# EasyEDA Pro project 无刷电机驱动板.epro, board PCB3
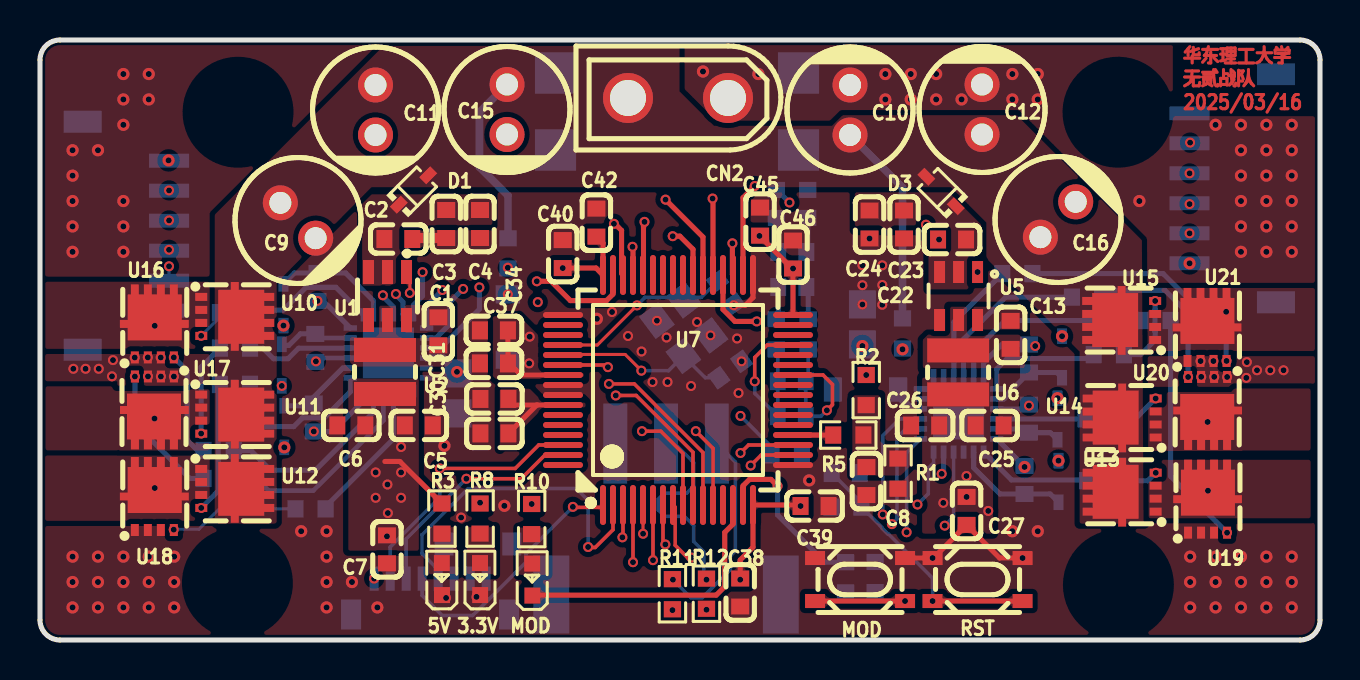
[diagram p9: board, top side]
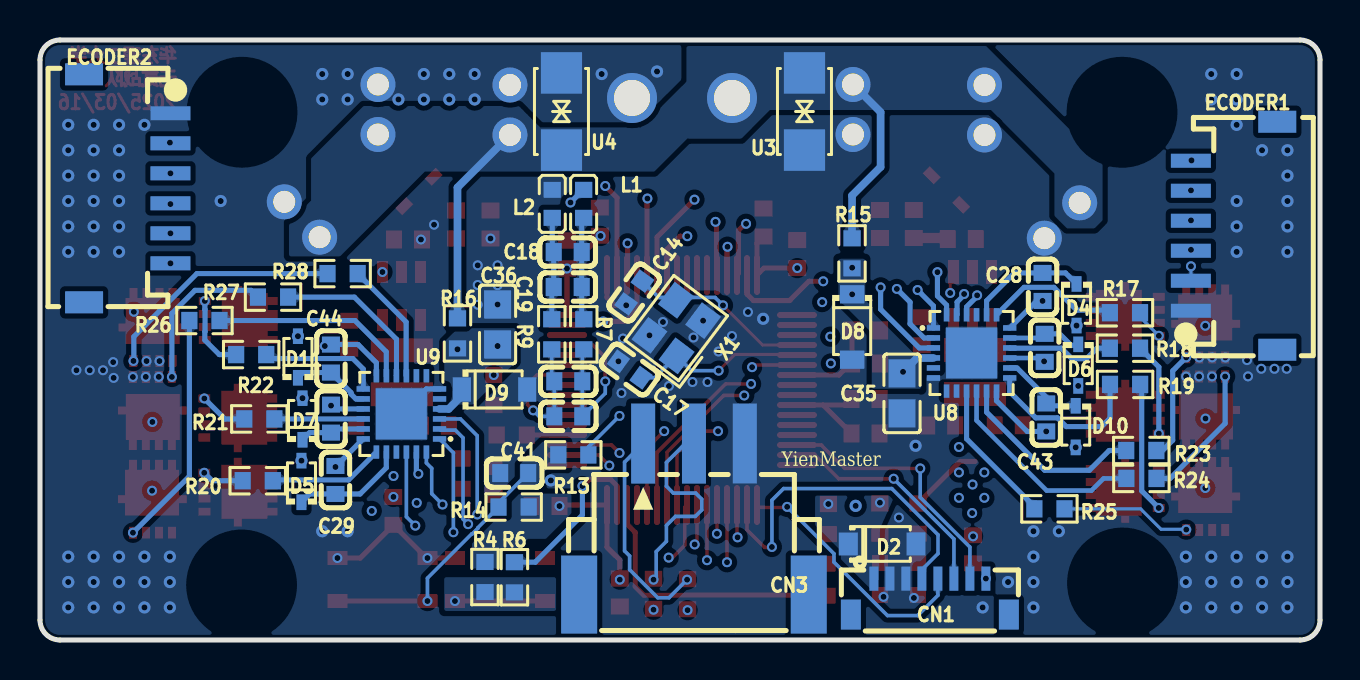
[diagram p10: board, bottom side, seen from below]

Outline 64 x 30 mm; copper layers: Top Layer, Inner1, Inner2, Inner3, Inner4, Bottom Layer. Coordinates in mm from the lower left corner of the outline.
Outline path: 0,29 0,1 arc(0.29,0.29) 1,0 63,0 arc(63.71,0.29) 64,1 64,29 arc(63.71,29.71) 63,30 1,30 arc(0.29,29.71) 0,29
Stack: Top Layer 0.035mm 外层铜厚1oz / Dielectric1 0.0994mm 3313 RC57% 4.2mil / Inner1 0.0152mm 内层铜厚 / Dielectric2 0.55mm 0.55mm H/H No copper / Inner2 0.0152mm 内层铜厚 / Dielectric3 0.1088mm 2116 RC54% 4.9mil / Inner3 0.0152mm 内层铜厚 / Dielectric4 0.55mm 0.55mm H/H No copper / Inner4 0.0152mm 内层铜厚 / Dielectric5 0.0994mm 3313 RC57% 4.2mil / Bottom Layer 0.035mm 外层铜厚1oz

## Design rules (mm)
net ECO_IN: DP1
net ECO_OUT: DP1
net UART_TX: DP2
net UART_RX: DP2
net $1N18423: DP3
net $1N18427: DP3
template: 自定义配置
spacing copperThickness1oz (default): track to track 0.102, other pairs 0.152 to 0.3
spacing copperThickness2oz: track to track 0.203, other pairs 0.152 to 0.3
track width copperThickness1oz (default): min 0.127, default 0.254, max 2.54
track width copperThickness2oz: min 0.203, default 0.254, max 2.54
differential pair differentialPair (default): width min 0.127, default 0.254, max 2.54; gap min 0.152, default 0.152
via viaSize (default): diameter min 0.5, default 0.61, max 10; hole min 0.3, default 0.305, max 6.3

## Placement (name value [footprint] x y rotation side)
3.3V  NCD0603R1  [LED0603-RD_RED]  22 3.05 90 top
5V  NCD0603R1  [LED0603-RD_RED]  20.1 3.05 90 top
C1  100nF  [C0603]  19.92 15.43 270 top
C2  10uF  [C0603]  17.91 20.05 180 top
C3  100nF  [C0603]  20.31 20.8 90 top
C4  10nF  [C0603]  22 20.8 90 top
C5  22uF  [C0603]  18.94 10.73 180 top
C6  22uF  [C0603]  15.56 10.73 0 top
C7  100nF  [C0603]  17.35 4.53 270 top
C8  100nF  [C0603]  41.32 7.95 90 top
C9  220uF  [CAP-TH_BD6.3-P2.50-D0.6-FD-1]  12.9 20.97 315 top
C10  220uF  [CAP-TH_BD6.3-P2.50-D0.6-FD-1]  40.5 26.5 90 top
C11  220uF  [CAP-TH_BD6.3-P2.50-D0.6-FD-1]  16.78 26.5 270 top
C12  220uF  [CAP-TH_BD6.3-P2.50-D0.6-FD-1]  47.1 26.53 90 top
C13  100nF  [C0603]  48.53 15.26 270 top
C14  10pF  [C0603]  34.29 17.37 305.7 bottom
C15  220uF  [CAP-TH_BD6.3-P2.50-D0.6-FD-1]  23.35 26.53 270 top
C16  220uF  [CAP-TH_BD6.3-P2.50-D0.6-FD-1]  50.9 21.02 45 top
C17  10pF  [C0603]  34.51 13.52 215.8 bottom
C18  4.7uF  [C0603]  37.62 19.4 180 bottom
C19  100nF  [C0603]  37.62 17.65 180 bottom
C20  2.2uF  [C0603]  37.59 12.93 180 bottom
C21  100nF  [C0603]  37.59 11.18 180 bottom
C22  10uF  [C0603]  45.6 20.02 0 top
C23  100nF  [C0603]  43.2 20.77 90 top
C24  10nF  [C0603]  41.48 20.77 90 top
C25  22uF  [C0603]  47.48 10.72 180 top
C26  22uF  [C0603]  44.26 10.72 0 top
C27  100nF  [C0603]  46.33 6.45 270 top
C28  4.7uF  [C0603]  13.87 17.65 90 bottom
C29  4.7uF  [C0603]  49.23 8 270 bottom
C30  4.7uF  [C0603]  22.72 10.33 180 top
C31  100nF  [C0603]  22.72 12.05 180 top
C32  4.7uF  [C0603]  13.77 14.61 90 bottom
C33  4.7uF  [C0603]  49.45 11.07 270 bottom
C34  4.7uF  [C0603]  22.7 13.83 180 top
C35  22uF  [C0805]  20.9 12.33 90 bottom
C36  22uF  [C0805]  41.12 15.78 270 bottom
C37  100nF  [C0603]  22.7 15.48 180 top
C38  4.7uF  [C0603]  35.01 2.38 90 top
C39  100nF  [C0603]  38.73 6.7 180 top
C40  4.7uF  [C0603]  26.14 19.3 90 top
C41  100nF  [C0603]  40.29 8.35 180 bottom
C42  100nF  [C0603]  27.82 20.87 90 top
C43  4.7uF  [C0603]  13.69 11.13 270 bottom
C44  4.7uF  [C0603]  49.45 14.07 90 bottom
C45  4.7uF  [C0603]  36 20.92 270 top
C46  100nF  [C0603]  37.65 19.27 270 top
CN1  HC-0.8-8PWT  [CONN-SMD_8P-P0.80_HCTL_HC-0.8-8PWT]  19.51 2.17 180 bottom
CN2  XT30UPB-M  [CONN-TH_XT30UPB-M]  31.9 27.1 180 top
CN3  ZX-XH2.54-3PWT  [CONN-SMD_3P-P2.54-XH2.54-WT]  31.3 6.05 180 bottom
D1  B5819WS  [SOD-323_L1.7-W1.3-LS2.5-FD]  18.68 22.5 225 top
D2  SMF3.3A  [SOD-123_L2.8-W1.8-LS3.7-RD]  21.89 4.8 180 bottom
D3  B5819WS  [SOD-323_L1.7-W1.3-LS2.5-FD]  45.05 22.42 315 top
D4  B5819WS  [SOD-323_L1.7-W1.3-LS2.5-FD]  12.17 16.76 90 bottom
D5  B5819WS  [SOD-323_L1.7-W1.3-LS2.5-FD]  50.93 7.93 270 bottom
D6  B5819WS  [SOD-323_L1.7-W1.3-LS2.5-FD]  12.09 13.74 90 bottom
D7  B5819WS  [SOD-323_L1.7-W1.3-LS2.5-FD]  50.88 11.05 270 bottom
D8  BZT52C15  [SOD-123_L2.7-W1.6-LS3.7-RD]  23.39 15.65 270 bottom
D9  BZT52C15  [SOD-123_L2.7-W1.6-LS3.7-RD]  41.27 12.53 180 bottom
D10  B5819WS  [SOD-323_L1.7-W1.3-LS2.5-FD]  12.22 10.67 90 bottom
D11  B5819WS  [SOD-323_L1.7-W1.3-LS2.5-FD]  51.1 14.15 270 bottom
ECODER1  ZH-6AWB  [CONN-SMD_6P-P1.50_ZH-6AWB]  4.3 20.21 90 bottom
ECODER2  ZH-6AWB  [CONN-SMD_6P-P1.50_ZH-6AWB]  59.64 22.58 270 bottom
L1  BLM18PG121SN1D  [L0603]  36.82 21.81 270 bottom
L2  BLM18PG121SN1D  [L0603]  38.39 21.81 270 bottom
MOD  -  [SW-SMD_4P-L4.2-W3.2-P2.15-LS4.6-1]  41 3.02 0 top
MOD#2  -  [LED0603-RD_RED]  24.62 3.02 90 top
R1  1kΩ  [R0603]  42.9 8.32 90 top
R2  10kΩ  [R0603]  41.31 12.5 90 top
R3  4.7kΩ  [R0603]  20.1 6.07 270 top
R4  4.7kΩ  [R0603]  41.75 3.15 270 bottom
R5  100Ω  [R0603]  40.41 10.25 180 top
R6  100Ω  [R0603]  40.28 3.14 270 bottom
R7  0Ω  [R0603]  36.81 15.28 270 bottom
R8  1kΩ  [R0603]  22 6.07 270 top
R9  0Ω  [R0603]  38.41 15.28 270 bottom
R10  1kΩ  [R0603]  24.58 6.05 270 top
R11  100Ω  [R0603]  31.62 2.29 90 top
R12  100Ω  [R0603]  33.32 2.31 90 top
R13  100Ω  [R0603]  37.33 9.26 180 bottom
R14  10kΩ  [R0603]  40.32 6.65 180 bottom
R15  100Ω  [R0603]  23.4 19.33 270 bottom
R16  100Ω  [R0603]  43.13 15.33 270 bottom
R17  4.7Ω  [R0603]  9.75 16.36 180 bottom
R18  4.7Ω  [R0603]  9.75 14.59 180 bottom
R19  4.7Ω  [R0603]  9.75 12.78 180 bottom
R20  4.7Ω  [R0603]  53.11 7.96 0 bottom
R21  4.7Ω  [R0603]  53.03 11.05 0 bottom
R22  4.7Ω  [R0603]  53.44 14.27 0 bottom
R23  4.7Ω  [R0603]  8.94 9.48 180 bottom
R24  4.7Ω  [R0603]  8.93 8.08 180 bottom
R25  4.7Ω  [R0603]  13.53 6.56 180 bottom
R26  4.7Ω  [R0603]  55.78 15.97 0 bottom
R27  4.7Ω  [R0603]  52.35 17.14 0 bottom
R28  4.7Ω  [R0603]  48.87 18.32 0 bottom
RST  TS3425BA  [SW-SMD_4P-L4.2-W3.2-P2.15-LS4.6-1]  46.88 3.02 0 top
U1  AP63205WU-7  [TSOT-23-6_L2.9-W1.6-P0.95-LS2.8-BL]  17.38 17.2 180 top
U2  4.7uH  [IND-SMD_L3.0-W3.0_FTC303020D]  17.25 13.4 270 top
U3  SMAJ16CA  [DO-214AC_L4.3-W2.7-LS5.0-BI]  25.78 26.42 90 bottom
U4  SMAJ16CA  [DO-214AC_L4.3-W2.7-LS5.0-BI]  37.93 26.42 90 bottom
U5  AP63203WU-7  [TSOT-26_L2.9-W1.6-P0.95-LS2.8-BL]  45.93 17.2 180 top
U6  4.7uH  [IND-SMD_L3.0-W3.0_FTC303020D]  45.91 13.38 270 top
U7  CYT2BL3CAAQ0AZEGST  [LQFP-64_L10.0-W10.0-P0.50-LS12.0-BL]  31.9 12.5 0 top
U8  FD6288Q  [QFN-24_L4.0-W4.0-P0.50-BL-EP2.6]  17.42 14.35 270 bottom
U9  FD6288Q  [QFN-24_L4.0-W4.0-P0.50-BL-EP2.6]  45.93 11.3 90 bottom
U10  TPN2R703NL,L1Q(M  [TSON-8_L3.1-W3.1-P0.65-LS3.3-BL-EP]  9.74 16.18 270 top
U11  TPN2R703NL,L1Q(M  [TSON-8_L3.1-W3.1-P0.65-LS3.3-BL-EP]  9.74 11.29 270 top
U12  TPN2R703NL,L1Q(M  [TSON-8_L3.1-W3.1-P0.65-LS3.3-BL-EP]  9.74 7.58 270 top
U13  TPN2R703NL,L1Q(M  [TSON-8_L3.1-W3.1-P0.65-LS3.3-BL-EP]  54.11 7.39 90 top
U14  TPN2R703NL,L1Q(M  [TSON-8_L3.1-W3.1-P0.65-LS3.3-BL-EP]  54.11 11.1 90 top
U15  TPN2R703NL,L1Q(M  [TSON-8_L3.1-W3.1-P0.65-LS3.3-BL-EP]  54.08 15.98 90 top
U16  TPN2R703NL,L1Q(M  [TSON-8_L3.1-W3.1-P0.65-LS3.3-BL-EP]  5.72 15.81 0 top
U17  TPN2R703NL,L1Q(M  [TSON-8_L3.1-W3.1-P0.65-LS3.3-BL-EP]  5.72 11.5 180 top
U18  TPN2R703NL,L1Q(M  [TSON-8_L3.1-W3.1-P0.65-LS3.3-BL-EP]  5.72 7.17 0 top
U19  TPN2R703NL,L1Q(M  [TSON-8_L3.1-W3.1-P0.65-LS3.3-BL-EP]  58.38 7.04 0 top
U20  TPN2R703NL,L1Q(M  [TSON-8_L3.1-W3.1-P0.65-LS3.3-BL-EP]  58.38 11.48 180 top
U21  TPN2R703NL,L1Q(M  [TSON-8_L3.1-W3.1-P0.65-LS3.3-BL-EP]  58.35 15.63 0 top
X1  16MHz  [CRYSTAL-SMD_4P-L3.2-W2.5-BL]  32.19 15.6 127 bottom

## Footprints (pads in the part's own frame, mm; a bottom-side part is the same pattern mirrored in y, then rotated)
C0603
  rect 0.8x0.9 smd: 1(-0.7,0) 2(0.7,0)
C0805
  rect 1.41x1.35 smd: 1(-1,0) 2(1,0)
CAP-TH_BD6.3-P2.50-D0.6-FD-1
  round 1.75 hole 1.1: 1(-1.25,0) 2(1.25,0)
CONN-SMD_3P-P2.54-XH2.54-WT
  rect 1.2x4 smd: 1(-2.54,3.775) 2(0,3.775) 3(2.54,3.775)
  rect 1.8x3.9 smd: 4(-5.74,-3.775) 5(5.74,-3.775)
CONN-SMD_6P-P1.50_ZH-6AWB
  rect 0.7x2 smd: 1(-3.75,2.16) 2(-2.25,2.16) 3(-0.75,2.16) 4(0.75,2.16) 5(2.25,2.16) 6(3.75,2.16)
  rect 1.1x1.9 smd: 7(5.7,-2.159) 8(-5.7,-2.16)
CONN-SMD_8P-P0.80_HCTL_HC-0.8-8PWT
  rect 0.45x1.208 smd: 1(-2.8,0.898) 2(-2,0.898) 3(-1.2,0.898) 4(-0.4,0.898) 5(0.4,0.898) 6(1.2,0.898) 7(2,0.898) 8(2.8,0.898)
  rect 1x1.5 smd: 9(3.95,-0.898) 10(-3.95,-0.898)
CONN-TH_XT30UPB-M
  round 2.5 hole 1.8: 1(-2.5,0) 2(2.5,0)
CRYSTAL-SMD_4P-L3.2-W2.5-BL
  rect 1.4x1.2 smd: 1(-1.1,-0.85) 2(1.1,-0.85) 3(1.1,0.85) 4(-1.1,0.85)
DO-214AC_L4.3-W2.7-LS5.0-BI
  rect 2.07x2.06 smd: 1(-1.929,0) 2(1.929,0)
IND-SMD_L3.0-W3.0_FTC303020D
  rect 1.2x3.1 smd: 1(-1.1,0) 2(1.1,0)
L0603
  rect 0.8x0.864 smd: 1(-0.7,0) 2(0.7,0)
LED0603-RD_RED
  rect 0.8x0.8 smd: 1(-0.799,-0.004) 2(0.799,0.004)
LQFP-64_L10.0-W10.0-P0.50-LS12.0-BL
  oval 0.3x2 smd: 1(-3.75,-5.75) 2(-3.25,-5.75) 3(-2.75,-5.75) 4(-2.25,-5.75) 5(-1.75,-5.75) 6(-1.25,-5.75) 7(-0.75,-5.75) 8(-0.25,-5.75) 9(0.25,-5.75) 10(0.75,-5.75) 11(1.25,-5.75) 12(1.75,-5.75) 13(2.25,-5.75) 14(2.75,-5.75) 15(3.25,-5.75) 16(3.75,-5.75) 33(3.75,5.75) 34(3.25,5.75) 35(2.75,5.75) 36(2.25,5.75) 37(1.75,5.75) 38(1.25,5.75) 39(0.75,5.75) 40(0.25,5.75) 41(-0.25,5.75) 42(-0.75,5.75) 43(-1.25,5.75) 44(-1.75,5.75) 45(-2.25,5.75) 46(-2.75,5.75) 47(-3.25,5.75) 48(-3.75,5.75)
  oval 2x0.3 smd: 17(5.75,-3.75) 18(5.75,-3.25) 19(5.75,-2.75) 20(5.75,-2.25) 21(5.75,-1.75) 22(5.75,-1.25) 23(5.75,-0.75) 24(5.75,-0.25) 25(5.75,0.25) 26(5.75,0.75) 27(5.75,1.25) 28(5.75,1.75) 29(5.75,2.25) 30(5.75,2.75) 31(5.75,3.25) 32(5.75,3.75) 49(-5.75,3.75) 50(-5.75,3.25) 51(-5.75,2.75) 52(-5.75,2.25) 53(-5.75,1.75) 54(-5.75,1.25) 55(-5.75,0.75) 56(-5.75,0.25) 57(-5.75,-0.25) 58(-5.75,-0.75) 59(-5.75,-1.25) 60(-5.75,-1.75) 61(-5.75,-2.25) 62(-5.75,-2.75) 63(-5.75,-3.25) 64(-5.75,-3.75)
QFN-24_L4.0-W4.0-P0.50-BL-EP2.6
  rect 0.28x0.665 smd: 1(-1.25,-1.907) 2(-0.75,-1.907) 3(-0.25,-1.907) 4(0.25,-1.907) 5(0.75,-1.907) 6(1.25,-1.907) 13(1.25,1.907) 14(0.75,1.907) 15(0.25,1.907) 16(-0.25,1.907) 17(-0.75,1.907) 18(-1.25,1.907)
  rect 0.665x0.28 smd: 7(1.907,-1.25) 8(1.907,-0.75) 9(1.907,-0.25) 10(1.907,0.25) 11(1.907,0.75) 12(1.907,1.25) 19(-1.907,1.25) 20(-1.907,0.75) 21(-1.907,0.25) 22(-1.907,-0.25) 23(-1.907,-0.75) 24(-1.907,-1.25)
  rect 2.55x2.55 smd: 25(0,0)
R0603
  rect 0.806x0.864 smd: 1(-0.753,0) 2(0.753,0)
SOD-123_L2.7-W1.6-LS3.7-RD
  rect 0.91x1.22 smd: 1(-1.635,0) 2(1.635,0)
SOD-123_L2.8-W1.8-LS3.7-RD
  rect 0.95x1.15 smd: 1(-1.692,0) 2(1.692,0)
SOD-323_L1.7-W1.3-LS2.5-FD
  rect 0.78x0.5 smd: 1(-1.04,0) 2(1.04,0)
SW-SMD_4P-L4.2-W3.2-P2.15-LS4.6-1
  rect 1x0.7 smd: 1(-2.25,1.075) 2(2.25,1.075) 3(-2.25,-1.075) 4(2.25,-1.075)
TSON-8_L3.1-W3.1-P0.65-LS3.3-BL-EP
  rect 0.4x0.6 smd: 1(-0.975,-1.675) 2(-0.325,-1.675) 3(0.325,-1.675) 4(0.975,-1.675) 5(0.975,1.675) 6(0.325,1.675) 7(-0.325,1.675) 8(-0.975,1.675)
  rect 0.6x0.4 smd: 9(-1.42,0) 9(1.42,0)
  rect 2.7x2.3 smd: 9(0.02,0.325)
TSOT-23-6_L2.9-W1.6-P0.95-LS2.8-BL
  rect 0.55x1.2 smd: 1(-0.95,-1.2) 2(0,-1.2) 3(0.95,-1.2) 4(0.95,1.2) 5(0,1.2) 6(-0.95,1.2)
TSOT-26_L2.9-W1.6-P0.95-LS2.8-BL
  rect 0.55x1.1 smd: 1(-0.95,-1.2) 2(0,-1.2) 3(0.95,-1.2) 4(0.95,1.2) 5(0,1.2) 6(-0.95,1.2)

## Nets
As in the schematic, except:
GND: 3.3V.1 5V.1 C2.1 C3.1 C4.1 C5.1 C6.1 C7.2 C8.1 C9.2 C10.2 C11.2 C12.2 C14.2 C15.2 C16.2 C17.1 C22.1 C23.1 C24.1 C25.1 C26.1 C27.2 C30.2 C31.2 C34.2 C35.1 C36.1 C37.2 C38.1 C39.1 C40.2 C41.1 C42.2 C45.1 C46.1 CN1.2 CN1.3 CN2.1 CN3.3 D2.2 D8.2 D9.2 ECODER1.1 ECODER2.1 L2.1 MOD.1 MOD.2 R1.1 RST.1 RST.2 U1.4 U3.1 U4.2 U5.4 U7.17 U7.33 U7.49 U7.56 U7.57 U8.6 U8.25 U9.6 U9.25 U16.1 U16.2 U16.3 U17.1 U17.2 U17.3 U18.1 U18.2 U18.3 U19.1 U19.2 U19.3 U20.1 U20.2 U20.3 U21.1 U21.2 U21.3 X1.2 X1.4
LEDMOD: MOD#2.1 U7.14
RST: C41.2 CN1.8 R13.1 R14.1 RST.3 RST.4
$1N10004: MOD.3 MOD.4 R4.2 R6.2
$1N10532: 3.3V.2 R8.2
$1N10536: MOD#2.2 R10.2
$1N11617: 5V.2 R3.2

Pads without a net: CN1 9 10; CN3 4 5; ECODER1 7 8; ECODER2 7 8; U7 13 21 22 23 24 25 30 31 40 41 42 43 50 51; U8 5 7 8 21; U9 5 7 8 21

## Via types
v1: diameter 0.61, hole 0.305, Top Layer to Bottom Layer, 99 vias
v2: diameter 0.5, hole 0.3, Top Layer to Bottom Layer, 154 vias
v3: diameter 0.5, hole 0.299, Top Layer to Bottom Layer, 7 vias
v4: diameter 0.584, hole 0.3, Top Layer to Bottom Layer, 1 via
v5: diameter 0.61, hole 0.3, Top Layer to Bottom Layer, 1 via

## Routing (per net, layer and track width the routed paths; a pad name or vN(x,y) marks a point on that pad's centre or on a via; arc(x,y) is an arc through that point)
+5V: length 130.4
  Top Layer w0.152: v2(18.49,17.35) 18.49,18.24 U1.1
  Top Layer w0.254: R3.1 18,8.93 17.24,8.93
  Inner3 w0.254: 17.58,10.42 19.86,10.42 22.88,13.44 22.88,15.95 24.05,17.12 24.05,19.36 23.6,19.81 21.69,19.81 19.22,17.35 v2(18.49,17.35)
  Inner3 w0.381: v1(57.48,18.83) 57.55,18.76 62.75,18.76 63.02,18.49 63.02,6.58 52.78,6.58 47.1,0.9 24.25,0.9 v2(17.37,7.78) 7.54,7.78 6.5,6.73 2.12,6.73 1.07,7.78 1.07,17.26 2.91,19.1 2.91,23.47 3.42,23.98 v1(6.43,23.98)
  vias: v2(17.35,5.18) v3(16.78,8.38) v3(16.78,7.11) v3(17.39,6.35) v3(18.05,9.65) v3(18.05,8.38) v3(18.05,7.11)
GND: length 13.6
  Top Layer w0.254: v2(34.69,16.74) 35.26,16.74 35.65,17.12 35.65,18.25 U7.33 ; MOD.2 v2(44.63,4.1) 44.67,4.1 C27.2 47.98,4.1 v2(49.13,4.1)
  Top Layer w0.508: C2.1 18.66,20.1 C3.1
  Bottom Layer w0.254: U9.25 44.68,12.55 44.02,12.55
  vias: v1(1.63,24.49) v1(1.63,23.22) v1(1.63,21.95) v1(1.63,20.68) v1(1.63,19.41) v1(1.63,4.17) v1(1.63,2.9) v1(1.63,1.63) v1(2.9,24.49) v1(2.9,4.17) v1(2.9,2.9) v1(2.9,1.63) v1(4.17,28.3) v1(4.17,27.03) v1(4.17,25.76) v1(4.17,21.95) v1(4.17,20.68) v1(4.17,19.41) v1(4.17,4.17) v1(4.17,2.9) v1(4.17,1.63) v1(5.44,28.3) v1(5.44,27.03) v1(5.44,4.17) v1(5.44,2.9) v1(5.44,1.63) v1(6.71,4.17) v1(6.71,2.9) v1(6.71,1.63) v1(13.06,5.44) v1(14.33,5.44) v1(14.33,4.17) v1(14.33,2.9) v1(14.33,1.63) v1(15.6,2.9) v1(16.87,1.63) v1(20.22,9.71) v1(23.22,6.71) v1(27.84,16.06) v1(33.15,28.42) v1(35.92,28.3) v1(38.46,7.98) v1(42.27,28.3) v1(42.27,27.03) v1(43.54,28.3) v1(43.54,27.03) v1(44.81,28.3) v1(44.81,27.03) v1(46.08,27.03) v1(48.62,28.3) v1(48.62,27.03) v1(48.62,5.44) v1(49.89,28.3) v1(49.89,27.03) v1(49.89,5.44) v1(54.97,21.95) v1(57.51,4.17) v1(57.51,2.9) v1(57.51,1.63) v1(58.78,25.76) v1(58.78,4.17) v1(58.78,2.9) v1(58.78,1.63) v1(60.05,25.76) v1(60.05,24.49) v1(60.05,23.22) v1(60.05,21.95) v1(60.05,20.68) v1(60.05,19.41) v1(60.05,4.17) v1(60.05,2.9) v1(60.05,1.63) v1(61.32,25.76) v1(61.32,24.49) v1(61.32,23.22) v1(61.32,21.95) v1(61.32,20.68) v1(61.32,19.41) v1(61.32,4.17) v1(61.32,2.9) v1(61.32,1.63) v1(62.59,25.76) v1(62.59,24.49) v1(62.59,23.22) v1(62.59,21.95) v1(62.59,20.68) v1(62.59,19.41) v1(62.59,4.17) v1(62.59,2.9) v1(62.59,1.63) v2(1.67,13.56) v2(2.28,13.56) v2(2.94,13.56) v2(3.65,14) v2(4.74,14.12) v2(5.39,14.13) v2(5.4,13.18) v2(6.04,14.12) v2(6.04,13.17) v2(6.69,13.17) v2(20.3,2.1) v2(21.06,6.12) v2(21.82,2.16) v2(28.6,16.4) v2(29.4,15.2) v2(30.08,14.42) v2(30.63,12.9) v2(30.85,15.97) v2(31.33,15.12) v2(31.38,12.9) v2(32.55,12.7) v2(32.85,15.9) v2(33.53,15.23) v2(34.85,15.08) v2(34.93,12.35) v2(35.08,13.93) v2(41.12,18.73) v2(41.12,17.74) v2(41.12,16.78) v2(41.48,20.07) v2(42.11,18.73) v2(42.11,17.75) v2(42.11,16.76) v2(44.3,20.77) v2(44.95,20.02) v2(58.03,13.95) v2(58.06,13.16) v2(58.67,13.95) v2(58.71,13.16) v2(59.36,13.15) v2(60.34,13.89) v2(60.32,13.11) v2(60.85,13.49) v2(61.51,13.49) v2(62.18,13.49) v3(3.6,13.18)
VBAT: length 40.2
  Inner2 w0.254: v2(41.31,13.25) 40.04,14.52 36.15,14.52 32.67,18 32.67,23.83 CN2.2
  Bottom Layer w0.381: R15.1 23.4,22.22 21.97,23.65 21.97,26.39 C15.1 ; C10.1 43.13,22.63 R16.1
VCC1V1: length 4.9
  Top Layer w0.254: 24.84,11.75 23.72,11.75 C31.1 ; 24.84,11.75 U7.58 ; 24.84,11.75 C30.1
VCC3V3: length 36.8
  Top Layer w0.254: C37.1 23.4,13.9 24.05,13.25 U7.55 ; v2(26.14,18.6) 27.8,18.6 U7.48 28.15,19.84 C42.1 ; U7.32 37.65,18.53 v2(35.97,20.2) ; v2(35.01,3.02) 35.01,4 35.65,4.64 U7.16 37.98,6.75 v2(38.03,6.7)
  Inner2 w0.254: v2(46.32,8.2) 46.88,8.75 v2(46.88,18.4)
  Inner3 w0.178: v2(22,6.87) 22,7.5 24.05,9.55 ; v2(24.58,6.8) 24.58,8.28 25.02,8.72
  Bottom Layer w0.254: v2(37.47,21.88) 36.84,22.51 L1.1
  vias: v2(24.48,15.17) v2(24.46,13.83) v2(24.89,16.89) v2(37.65,18.57) v2(45.16,6.86) v2(46.33,7.15) v2(47.41,6.45)
BATADC: length 2
  Top Layer w0.254: R5.2 37.65,10.25 U7.20
DBG_RX: length 12.8
  Top Layer w0.178: U7.1 28.03,6.63 26.64,6.63
  Bottom Layer w0.178: CN1.5 19.11,2.23 20.12,1.22 21.63,1.22 24.3,3.9 24.3,4.32 v2(26.64,6.66)
DBG_TX: length 17.2
  Top Layer w0.178: 27.41,4.63 27.76,4.63 28.65,5.51 U7.2
  Bottom Layer w0.178: 27.41,4.65 27.41,6.99 26.82,7.57 21.41,7.57 19.1,5.26 19.1,4.32 19.91,3.51 CN1.4
  vias: v2(27.41,4.65)
ECD1_CS: length 35.6
  Top Layer w0.178: U7.12 33.65,6.75 33.65,9.58 v2(32.79,10.44)
  Inner2 w0.178: v2(6.45,18.69) 6.73,18.4 7.09,18.4 16.37,9.12 29.52,9.12 30.85,10.44 v2(32.79,10.44)
  Bottom Layer w0.152: v2(6.45,18.69) 6.45,17.97 ECODER1.2
ECD1_MISO: length 32.5
  Top Layer w0.178: U7.9 32.15,9.33 31.04,10.44 v2(30.1,10.44)
  Inner2 w0.178: v2(30.1,10.44) 16.03,10.44 6.97,19.51 v2(6.45,19.51)
ECD1_MOSI: length 33.6
  Top Layer w0.178: U7.10 32.65,9.39 29.81,12.23 v2(28.79,12.23)
  Inner2 w0.178: v2(28.79,12.23) 16.44,12.23 8.75,19.91 7.52,19.91 v2(6.45,20.98)
ECD1_SCLK: length 34.7
  Top Layer w0.178: U7.11 33.15,9.37 29.72,12.8 v2(28.45,12.8)
  Inner2 w0.178: v2(28.45,12.8) 16.6,12.8 6.92,22.48 v2(6.45,22.48)
ECD2_CS: length 29.3
  Top Layer w0.254: v2(33.63,22.07) 33.65,22.05 U7.37
  Inner2 w0.254: v2(33.63,22.07) 33.63,22.74 34.63,23.74 55.47,23.74 56.6,24.87 v2(57.5,24.87)
ECD2_MISO: length 26.7
  Top Layer w0.254: v2(35.74,22.7) 35.15,22.11 U7.34
  Inner2 w0.254: 57.45,23.42 57.09,23.06 36.1,23.06 v2(35.74,22.7)
  vias: v2(57.48,23.33)
ECD2_MOSI: length 26.1
  Top Layer w0.254: v2(34.62,19.83) 34.62,18.28 U7.35
  Inner2 w0.254: v2(34.62,19.83) 34.62,20.43 35.49,21.3 50.77,21.3 51.31,20.75 52.26,20.75 52.81,21.3 56.98,21.3 v2(57.48,21.8)
ECD2_SCLK: length 27.1
  Top Layer w0.254: U7.36 34.15,16.53 34.75,15.93 v2(35.84,15.93)
  Inner2 w0.254: v2(57.48,20.33) 56.13,18.99 45.68,18.99 42.62,15.93 v2(35.84,15.93)
ECO_IN: length 8.9
  Top Layer w0.152: U7.53 26.82,14.25 26.84,14.28 29.26,14.28 v2(30.07,13.47)
  Bottom Layer w0.178: C17.2 33.26,13.11 X1.1 31.43,13.47 v2(30.07,13.47)
ECO_OUT: length 9.1
  Top Layer w0.152: v2(29.85,16.73) 27.87,14.75 U7.52
  Bottom Layer w0.178: v2(29.85,16.73) 30.25,17.13 33.06,17.13 C14.1
HOA1: length 6.8
  Bottom Layer w0.254: R17.1 10.63,16.49 12.16,16.49 13.31,17.63 14.8,17.63 U8.19
HOA2: length 5.8
  Bottom Layer w0.254: R20.1 52.32,8 48.57,8 U9.19
HOB1: length 5.4
  Bottom Layer w0.254: R18.1 11.15,14.59 11.67,14.06 12.4,14.06 12.93,14.59 15.5,14.59 U8.16
HOB2: length 4.4
  Bottom Layer w0.254: U9.16 52.28,11.05
HOC1: length 8.3
  Bottom Layer w0.254: U8.13 15.51,12.41 14.21,11.11 13.12,11.11 12.69,10.67 10.92,10.67 10.5,11.09 R19.1
HOC2: length 6.1
  Bottom Layer w0.254: U9.13 47.84,13.55 48.36,14.07 52.49,14.07 R22.1
KEYMOD: length 8.8
  Top Layer w0.254: v2(36.88,7.7) 36.55,8.03 35.47,8.03 35.15,7.71 U7.15
  Bottom Layer w0.254: v2(36.88,7.7) 36.88,6.25 39.24,3.89 R6.1
LEDMOD: length 14.1
  Top Layer w0.254: U7.14 34.65,5.79 34.24,5.38 34.24,2.67 33.81,2.24 24.64,2.24 MOD#2.1
LOA1: length 9.6
  Bottom Layer w0.254: U8.11 16.67,11.39 13.77,8.49 11.53,8.49 10.54,9.48 R23.1
LOA2: length 10.2
  Bottom Layer w0.254: U9.11 46.68,13.21 46.68,14.4 48.25,15.97 R26.1
LOB1: length 10.7
  Bottom Layer w0.229: R24.1 10.82,8.08 11.43,7.47 13.66,7.47 17.17,10.98 U8.10
LOB2: length 8.1
  Bottom Layer w0.254: R27.1 48.28,17.14 46.18,15.04 46.18,13.22 U9.10
LOC1: length 7.3
  Bottom Layer w0.254: R25.1 14.28,6.67 17.67,10.06 U8.9
LOC2: length 6.1
  Bottom Layer w0.254: U9.9 45.69,13.22 45.69,15.9 R28.1
PWM1AH: length 23.7
  Top Layer w0.254: v2(31.28,22.02) 33.15,20.14 U7.38
  Inner2 w0.254: v2(17.14,17.23) 17.14,20.35 18.81,22.02 v2(31.28,22.02)
  Bottom Layer w0.254: v2(17.14,17.23) 17.14,17.18 17.67,16.66 U8.22
PWM1AL: length 18.6
  Top Layer w0.254: 32.68,18.28 U7.39 32.65,19.53 31.99,20.19 v2(31.63,20.19)
  Inner2 w0.254: v2(31.63,20.19) 20.85,20.19 20.12,19.46 v2(20.12,17.5)
  Bottom Layer w0.254: v2(20.12,17.5) 19.33,16.71 U8.1
PWM1BH: length 20
  Top Layer w0.254: U7.44 30.15,18.3 30.17,18.32 30.17,20.86 v2(30.22,20.91)
  Inner2 w0.254: v2(30.22,20.91) 29.69,21.44 18.9,21.44 17.8,20.34 v2(17.8,17.3)
  Bottom Layer w0.254: U8.23 18.15,16.28 18.15,16.9 17.8,17.25 v2(17.8,17.3)
PWM1BL: length 15
  Top Layer w0.254: U7.45 29.65,19.64 v2(29.62,19.66)
  Inner2 w0.254: v2(29.62,19.66) 21.97,19.66 21.44,19.13 21.44,17.84 v2(21.16,17.55)
  Bottom Layer w0.254: v2(21.16,17.55) 20.5,16.89 20.5,15.8 19.8,15.1 U8.2
PWM1CH: length 16.5
  Top Layer w0.254: v2(28.7,20.81) 28.75,20.81 29.08,20.48 29.08,18.37 29.1,18.35 29.1,18.3 U7.46
  Inner2 w0.254: v2(28.7,20.81) 20.17,20.81 19.13,19.77 v2(19.13,18.39)
  Bottom Layer w0.254: U8.24 18.67,16.74 19.13,17.2 v2(19.13,18.39)
PWM1CL: length 12.8
  Top Layer w0.254: U7.47 28.65,17.29 28.33,16.97 26.52,16.97 25.55,17.94 v2(24.84,17.94)
  Inner2 w0.254: v2(21.97,17.63) 22.27,17.94 v2(24.84,17.94)
  Bottom Layer w0.254: v2(21.97,17.63) 21.97,16.54 20.03,14.6 U8.3
PWM2AH: length 25.8
  Top Layer w0.178: U7.3 29.15,5.16 v2(29.12,5.13)
  Inner2 w0.178: v2(29.12,5.13) 29.12,2.86 29.97,2 41.52,2 v2(45.24,5.72)
  Bottom Layer w0.178: v2(45.24,5.72) 45.68,6.16 U9.22
PWM2AL: length 23.3
  Top Layer w0.178: U7.4 v2(29.65,3.89)
  Inner2 w0.178: v2(29.65,3.89) 31.07,2.47 40.41,2.47 v2(43.33,5.39)
  Bottom Layer w0.178: v2(43.33,5.39) 43.33,9.36 44.02,10.05
PWM2BH: length 18.7
  Top Layer w0.152: v2(30.15,5.31) 30.15,6.75 U7.5
  Inner2 w0.178: v2(45.08,8.31) 44.04,7.27 41.74,7.27 39.81,5.34 30.18,5.34 v2(30.15,5.31)
  Bottom Layer w0.254: v2(45.08,8.31) 45.18,8.41 U9.23
PWM2BL: length 21.6
  Top Layer w0.178: U7.6 v2(30.65,3.99)
  Inner2 w0.178: v2(42.59,5.79) 40.31,3.51 31.13,3.51 v2(30.65,3.99)
  Bottom Layer w0.178: v2(42.59,5.79) 42.85,6.05 42.85,10.11 43.23,10.49 43.96,10.49 44.02,10.55
PWM2CH: length 18.5
  Top Layer w0.178: U7.7 31.15,4.9 v2(31.27,4.78)
  Inner2 w0.178: v2(43.87,6.77) 41.94,6.77 39.78,4.61 31.43,4.61 v2(31.27,4.78)
  Bottom Layer w0.178: v2(43.87,6.77) 44.41,7.32 44.41,8.59 44.68,8.85 U9.24
PWM2CL: length 19.8
  Top Layer w0.178: v2(32.57,4.12) 32.38,4.12 31.76,4.74 31.76,6.64 U7.8
  Inner2 w0.178: v2(32.57,4.12) 39.98,4.12 v2(42.14,6.28)
  Bottom Layer w0.178: 44.02,11.05 42.98,11.05 42.14,10.21 v2(42.14,6.28)
RST: length 42.6
  Top Layer w0.254: v2(44.63,1.95) RST.4
  Inner2 w0.178: v2(44.63,1.95) 43.34,0.66 18.77,0.66 16.74,2.7 16.74,3.08
  Bottom Layer w0.178: C41.2 41.07,6.86 R14.1 42.1,5.62 42.1,5.59 42.39,5.3 42.42,5.3 44.63,3.09 v2(44.63,1.95)
  vias: v2(16.71,3.07)
SWCLK: length 13.2
  Top Layer w0.178: U7.62 24.94,9.75 23.76,8.58 v2(19.99,8.58)
  Bottom Layer w0.178: CN1.7 17.51,4.65 19.99,7.13 v2(19.99,8.58)
SWDIO: length 11.6
  Top Layer w0.178: U7.63 25.25,9.25 24.06,8.06 v2(21.32,8.06)
  Bottom Layer w0.178: v2(21.32,8.06) 18.31,5.05 CN1.6
UART_RX: length 22
  Top Layer w0.178: U7.18 36.06,9.25 v2(35.53,8.72)
  Inner2 w0.178: v2(31.62,1.49) 29.01,1.49 28.24,2.26 28.24,3.36 28.63,3.74 28.63,5.28 28.24,5.67 28.24,6.62 28.68,7.06 29.14,7.06 29.89,6.3 30.53,6.3 31.06,6.84 31.06,7.24 30.2,8.11 30.2,8.58 30.64,9.02 31.7,9.02 31.99,8.72 v2(35.53,8.72)
UART_TX: length 22.2
  Top Layer w0.178: v2(35.03,9.35) 35.43,9.75 U7.19
  Inner2 w0.178: v2(35.03,9.35) 35,9.32 31.86,9.32 31.83,9.35 30.5,9.35 27.9,6.74 27.9,1.54 28.46,0.98 32.89,0.98 33.32,1.41 v2(33.32,1.51)
VBA1: length 6
  Bottom Layer w0.254: D4.2 12.73,18.35 C28.2 15.28,18.35 16.67,16.96 U8.20
VBA2: length 5.7
  Bottom Layer w0.254: U9.20 46.68,9.39 46.68,8.61 48,7.3 C29.2 50.51,7.3 D5.2
VBB1: length 3.8
  Bottom Layer w0.229: U8.17 13.85,15.1 13.64,15.31
  Bottom Layer w0.254: 12.04,14.73 12.44,14.73 13.02,15.31 13.64,15.31
VBB2: length 3.3
  Bottom Layer w0.254: U9.17 49.26,10.55 C33.2 50.52,10.37 D7.2
VBC1: length 4.3
  Bottom Layer w0.254: U8.14 15.15,13.6 13.69,12.14 C43.1 13.57,11.71 D10.2
VBC2: length 4
  Bottom Layer w0.254: U9.14 48.2,12.05 48.45,12.3 48.45,12.37 C44.1 50.84,13.37 D11.2
VREFH: length 9
  Top Layer w0.178: U7.29 36.36,14.75 35.74,14.12 v2(35.74,12.93)
  Bottom Layer w0.178: v2(35.74,12.93) 35.74,12.33 C21.2 C20.2 36.89,14.45 R7.2
VREFL: length 8.2
  Top Layer w0.178: v2(39.34,11.48) 39.62,11.76 39.62,12.78 39.15,13.25 U7.26
  Bottom Layer w0.178: v2(39.34,11.48) 39.04,11.18 C21.1 C20.1 38.41,13.06 R9.2
VSA1: length 10.9
  Inner3 w0.254: v2(5.74,15.71) 7.81,15.71 7.84,15.74 8.28,15.74 8.31,15.71 8.82,15.71 10.08,16.97 13.86,16.97 v2(13.87,16.95)
  Bottom Layer w0.254: v2(13.87,16.95) 14.16,16.95 U8.18
VSA2: length 11.6
  Inner3 w0.254: v5(49.23,8.65) 50.41,7.47 v2(58.4,7.47)
  Bottom Layer w0.254: C29.1 49.19,8.7 U9.18
VSB1: length 11
  Inner3 w0.254: v2(5.72,11.07) 7.44,11.07 10.3,13.93 v2(13.8,13.93)
  Bottom Layer w0.229: 15.51,14.1 13.96,14.1 v2(13.8,13.93)
VSB2: length 11
  Inner3 w0.254: v2(49.45,11.72) 50.29,10.87 58.35,10.87 v2(58.38,10.9)
  Bottom Layer w0.254: C33.1 49.23,11.55 U9.15
VSC1: length 12.7
  Inner3 w0.254: v2(13.69,10.43) 11.08,10.43 9.5,8.84 6.98,8.84 v2(5.74,7.6)
  Bottom Layer w0.254: U8.12 16.18,12.44 16.18,11.97 14.64,10.43 v2(13.69,10.43)
VSC2: length 13.7
  Inner3 w0.254: v2(49.76,14.7) 49.95,14.51 57.4,14.51 v2(59.31,16.41)
  Bottom Layer w0.254: U9.12 47.18,13.86 48.09,14.77 C44.2
XRES_L: length 12.5
  Top Layer w0.178: U7.54 28.29,13.75 v2(28.4,13.64)
  Inner2 w0.178: v2(28.4,13.64) 30.83,11.2 v2(35.03,11.2)
  Bottom Layer w0.178: v2(35.03,11.2) 36.58,9.65 R13.2
$1N9300: length 5.2
  Bottom Layer w0.254: R7.1 36.92,16.14 C19.2 C18.2 36.92,21.01 L1.2
$1N9320: length 5.1
  Bottom Layer w0.254: L2.2 38.39,19.47 C18.1 C19.1 38.41,17.56 R9.1
$1N10004: length 4.5
  Top Layer w0.254: MOD.3 v2(43.25,1.95)
$1N13568: length 1.8
  Bottom Layer w0.381: v4(20.85,13.41) 20.15,14.1 U8.4
  vias: v1(12.17,15.72) v1(12.22,9.63) v2(12.09,12.7) v2(23.39,18.62) v2(23.39,17.28)
$1N14919: length 1.7
  Bottom Layer w0.381: 44.02,11.55 43.57,11.55 42.91,12.21 D9.1
  vias: v1(41.12,14.7) v1(43.13,14.53) v1(50.88,12.09) v1(50.93,8.97) v1(51.1,15.19)
$1N15713: length 1.5
  Bottom Layer w0.152: R17.2 9,16.15 v2(8.06,15.21)
$1N16660: length 4.7
  Bottom Layer w0.254: v2(8.06,10.32) 8.06,13.65 R18.2
$1N16734: length 6.6
  Bottom Layer w0.254: v2(8.06,6.6) 8.91,7.45 8.91,12.7 R19.2
$1N16932: length 5.5
  Bottom Layer w0.254: v2(6.69,14.13) 7.36,13.46 7.36,9.98 7.9,9.45 8.21,9.45
$1N16944: length 6.9
  Bottom Layer w0.254: v2(4.74,13.17) 4.74,10.83 7.49,8.08 R24.2
$1N16956: length 6.5
  Bottom Layer w0.152: R25.2 8.97,6.56 7.95,5.54 6.7,5.54 v2(6.69,5.52)
$1N17340: length 2.1
  Bottom Layer w0.254: v2(55.79,8.36) 55.39,7.96 R20.2
$1N17352: length 2.4
  Bottom Layer w0.254: R21.2 54.76,11.05 v2(55.78,12.08)
$1N17364: length 3.8
  Bottom Layer w0.254: R22.2 55.03,14.27 55.76,14.99 55.76,15.42 55.75,15.43 55.75,16.52 55.76,16.53 v2(55.76,16.95)
$1N17376: length 11.8
  Bottom Layer w0.254: v2(59.35,5.37) 56.53,8.19 56.53,15.97
$1N17388: length 8.1
  Bottom Layer w0.254: R27.2 53.44,17.48 56.25,17.48 57.41,16.33 v2(57.41,13.15)
$1N17400: length 12.2
  Bottom Layer w0.254: v2(59.33,13.95) 59.31,13.97 59.31,15.17 56.15,18.32 R28.2
$1N18423: length 10.6
  Bottom Layer w0.178: v2(31.65,3.02) 32.55,2.11 33.11,2.11 34.52,3.52 34.52,4.2 34.77,4.45 34.77,8.89 33.84,9.82
$1N18427: length 10.6
  Bottom Layer w0.178: 31.3,9.82 31.73,9.82 32.68,8.88 32.68,7.69 32.33,7.34 31.22,7.34 30.91,7.04 30.91,6.5 31.24,6.18 32.23,6.18 32.68,5.73 32.68,4.93 33.19,4.42 33.19,3.15 v2(33.32,3.02)

## Copper pours and planes (outline as drawn; the poured copper is in the pictures)
+5V on Top Layer: 15.41,13.08 18.94,13.08 18.94,4.47 15.41,4.47
+5V on Inner3: 15.47,4.55 18.94,4.55 18.94,11.95 18.92,11.97 16.68,11.97 16.67,11.97 15.47,10.77
GND on Top Layer: -2.03,32.24 65.07,32.24 65.07,-1.52 -2.03,-1.52
GND on Top Layer: 3.86,14.77 7.34,14.77 7.34,12.7 3.86,12.7
GND on Top Layer: 18.09,20.63 22.62,20.63 22.62,19.5 18.09,19.5
GND on Bottom Layer: -3.2,34.19 66.45,34.19 66.45,-3.27 -3.2,-3.27
GND on Inner1: -6.05,36.32 68.4,36.32 68.4,-6.25 -6.05,-6.25
GND on Inner2: -8.08,37.98 70.15,37.98 70.15,-8.38 -8.08,-8.38
GND on Inner3: -10.06,40.01 71.73,40.01 71.73,-11.12 -10.06,-11.12
GND on Inner4: -11.86,41.91 72.26,41.91 72.26,-14.53 -11.86,-14.53
VBAT on Top Layer: 31.98,29.7 31.98,27.43 33.7,25.71 39.6,25.71 40.13,26.24 48.84,26.24 55.1,19.99 55.18,5.86 55.22,5.82 51.98,5.82 51.98,14.42 47.32,19.08 47.32,20.87 45.55,22.64 16.57,22.64 11.83,17.85 11.83,5.9 11.76,5.82 8.86,5.82 8.74,5.95 8.74,21.27 17.17,29.7
VBAT on Bottom Layer: 31.66,29.7 16.69,29.7 10.87,23.88 10.87,20.98 11.28,20.58 12.65,20.58 13.28,21.21 13.28,23.33 16.45,26.5 27.5,26.5 28.93,25.07 31.68,25.07 31.68,29.68
VBAT on Bottom Layer: 28.94,29.7 29.89,29.7 33.96,25.63 38.99,25.63 40.05,26.7 47.82,26.7 50.44,24.08 50.44,21.97 51.55,20.87 51.55,19.19 51.54,19.18 49,19.18 44.75,23.42 33.28,23.42 28.94,27.76
VCC1V1 on Top Layer: 23,12.56 24.49,12.56 25,12.05 27.12,12.05 27.28,11.89 27.28,11.48 27.25,11.46 25.01,11.46 24.11,10.55 24.11,9.76 24.03,9.68 23.11,9.68 22.99,9.55 22.99,12.55
VCC3V3 on Top Layer: 22.7,16.19 23.93,16.19 23.95,16.21 24.92,15.24 24.92,13.72 25.2,13.44 27.18,13.44 27.2,13.41 27.2,13.05 22.79,13.05 22.64,13.2 22.64,16.14
VCC3V3 on Top Layer: 44.11,13.13 47.65,13.13 47.65,5.32 44.11,5.32
VCC3V3 on Bottom Layer: 25.24,7.43 21.2,7.43 21.13,7.5 22,5.57 22.07,2.4 22.54,2.4 25.24,5.13
VCC3V3 on Bottom Layer: 37.43,7.32 40.03,7.32 42.4,4.95 42.4,3.65 42.44,3.61 42.41,3.58 41.09,3.58 39.61,5.06 38.71,5.06 37.43,6.34
VCC3V3 on Inner3: 33.02,9.61 39.69,2.95 47.65,2.95 47.65,9.61
VCC3V3 on Inner3: 47.65,7.38 47.65,10.74 47.08,11.3 47.08,12.92 47.09,12.93 46.18,13.84 39.88,13.84 39.55,14.18 39.55,21.36 37.85,23.05 27.39,23.05 23.67,19.33 23.67,17.12 22.7,16.15 22.7,13.6 22.73,13.57 21.16,11.99 21.11,11.99 25.71,7.38
RST on Bottom Layer: 37.65,9.92 38.86,9.92 40.01,8.78 40.01,7.55 38.93,7.55 38.93,8.19 38.53,8.6 37.65,8.6 37.64,8.59 37.64,9.91
VSA1 on Top Layer: 0.26,17.92 8.67,17.92 8.67,14.56 0.26,14.56
VSA2 on Top Layer: 55.34,9.01 63.53,9.01 63.53,6.09 55.34,6.09
VSB1 on Top Layer: 5.08,12.37 4.77,12.68 0.27,12.68 0.27,9.48 3.88,9.48 5.08,10.68
VSB1 on Top Layer: 3.88,12.53 8.53,12.53 8.53,9.48 3.88,9.48
VSB2 on Top Layer: 55.32,12.4 60.17,12.4 60.17,9.45 55.32,9.45
VSB2 on Top Layer: 63.53,12.57 59.73,12.57 59.55,12.4 59.55,9.52 59.5,9.47 63.53,9.47
VSC1 on Top Layer: 0.21,9.22 8.54,9.22 8.54,5.96 0.21,5.96
VSC2 on Top Layer: 55.26,17.6 63.77,17.6 63.77,14.45 55.26,14.45
$1N10004 on Bottom Layer: 38.16,3.14 43.79,3.14 43.79,1.45 38.16,1.45
$1N10532 on Top Layer: 21.34,5.65 22.75,5.65 22.75,3.29 21.34,3.29
$1N10536 on Top Layer: 23.92,5.62 25.36,5.62 25.36,3.26 23.92,3.26
$1N10766 on Top Layer: 40.65,12.23 42,12.23 42.01,12.25 42.01,9.93 42.24,9.7 43.54,9.7 43.56,9.68 43.56,8.74 43.04,8.23 40.61,8.23 40.61,12.04 40.64,12.07 40.64,12.22
$1N11613 on Top Layer: 17.88,16.74 20.62,16.74 20.62,15.23 17.88,15.23
$1N11614 on Top Layer: 16.94,16.72 16.94,15.37 16.71,15.14 15.49,15.14 15.49,13.9 15.72,13.67 20.5,13.67 20.6,13.77 20.6,15.06 20.62,15.09 18.1,15.09 17.96,15.23 17.96,16.66 17.91,16.72
$1N11615 on Top Layer: 22.62,22.29 22.62,20.75 22.6,20.73 19.42,20.73 19.42,19.64 19.21,19.43 18.12,19.43 17.91,19.23 17.91,17.72 16.11,17.72 16.11,22.29
$1N11617 on Top Layer: 19.44,5.65 20.84,5.65 20.84,3.29 19.44,3.29
$1N13568 on Bottom Layer: 22.74,19.06 24.07,19.06 24.08,19.05 24.08,17.02 22.42,15.36 22.42,12.56 19.97,12.56 19.94,12.53 19.94,14.2 22.74,17
$1N13568 on Inner3: 11.85,16.28 22.73,16.28 22.73,13.57 21.16,11.99 18.52,11.99 14.64,8.11 11.85,8.11
$1N13568 on Inner3: 23.8,17.23 23.8,19.33 23.17,19.33 19.92,16.13 22.7,16.13
$1N14919 on Bottom Layer: 40.22,13.9 40.22,15.59 43.1,15.59 43.79,14.9 43.79,13.03 43.38,12.63 43.38,11.81 43.35,11.77 42.35,11.77
$1N14919 on Inner3: 39.8,15.75 51.72,15.75 51.72,8.63 51.71,8.61 49.77,8.61 47.08,11.3 47.08,12.98 46.18,13.88 39.81,13.88 39.8,13.87
$1N19068 on Top Layer: 46.46,16.67 49.24,16.67 49.24,15.26 46.46,15.26
$1N19069 on Top Layer: 45.46,16.67 46.4,16.67 46.4,15.55 46.68,15.27 48.95,15.27 49.24,14.98 49.24,13.62 49.27,13.59 44.17,13.59 44.14,13.57 44.14,15.01 44.4,15.27 45.29,15.27 45.46,15.45
$1N19070 on Top Layer: 40.74,22.51 45.46,22.51 47.17,20.81 47.17,19.8 46.55,19.18 46.43,19.18 46.43,17.53 44.43,17.53 44.43,19.98 43.91,20.49 40.78,20.49 40.77,20.48 40.74,20.5

Small or netless copper shapes (teardrops, artwork), in the pictures only: 84 on Top Layer, 128 on Bottom Layer, 46 on Inner2, 16 on Inner3

## Text on the board
Bottom Silkscreen Layer: YienMaster
Top Layer: 华东理工大学 / 无贰战队 / 2025/03/16
Top Solder Mask Layer: 华东理工大学 / 无贰战队 / 2025/03/16
